# EAGLE schematic ESP-03_Breakout (EAGLE 7.4.0)
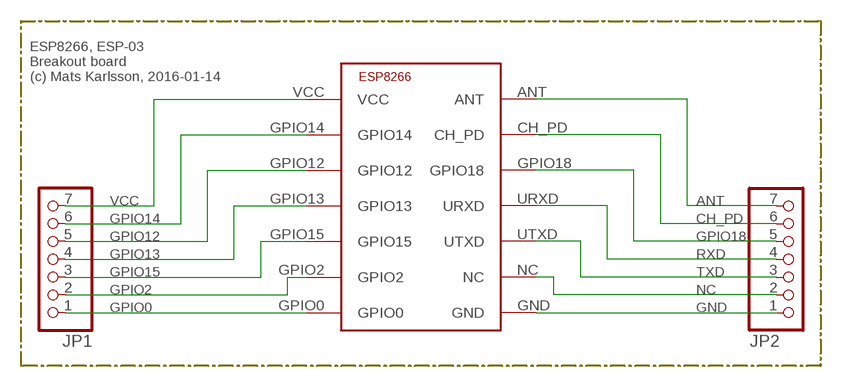
[diagram p0: schematic, sheet 1]

## Parts
JP1  PINHD-1X71X07_SMT  [1X07_SMT]
JP2  PINHD-1X71X07_SMT  [1X07_SMT]
U$1  ESP8266-03  [ESP-03]

## Nets
ANT: JP2.7 U$1.ANT
CH_PD: JP2.6 U$1.CH_PD
GND: JP2.1 U$1.GND
GPIO0: JP1.1 U$1.GPIO0
GPIO2: JP1.2 U$1.GPIO2
GPIO12: JP1.5 U$1.GPIO12
GPIO13: JP1.4 U$1.GPIO13
GPIO14: JP1.6 U$1.GPIO14
GPIO15: JP1.3 U$1.GPIO15
GPIO18: JP2.5 U$1.GPIO18
NC: JP2.2 U$1.NC
RXD: JP2.4 U$1.URXD
TXD: JP2.3 U$1.UTXD
VCC: JP1.7 U$1.VCC

## Notes on the sheet
- ESP8266, ESP-03
  Breakout board
  (c) Mats Karlsson, 2016-01-14

## Library data of the parts
JP1 JP2 = pinhead+:PINHD-1X7: PIN HEADER
U$1 = #ESP8266:ESP8266-03: ESP8266 - ESP-03 Module